# EAGLE design Spin_board2 (EAGLE 9.4.2)
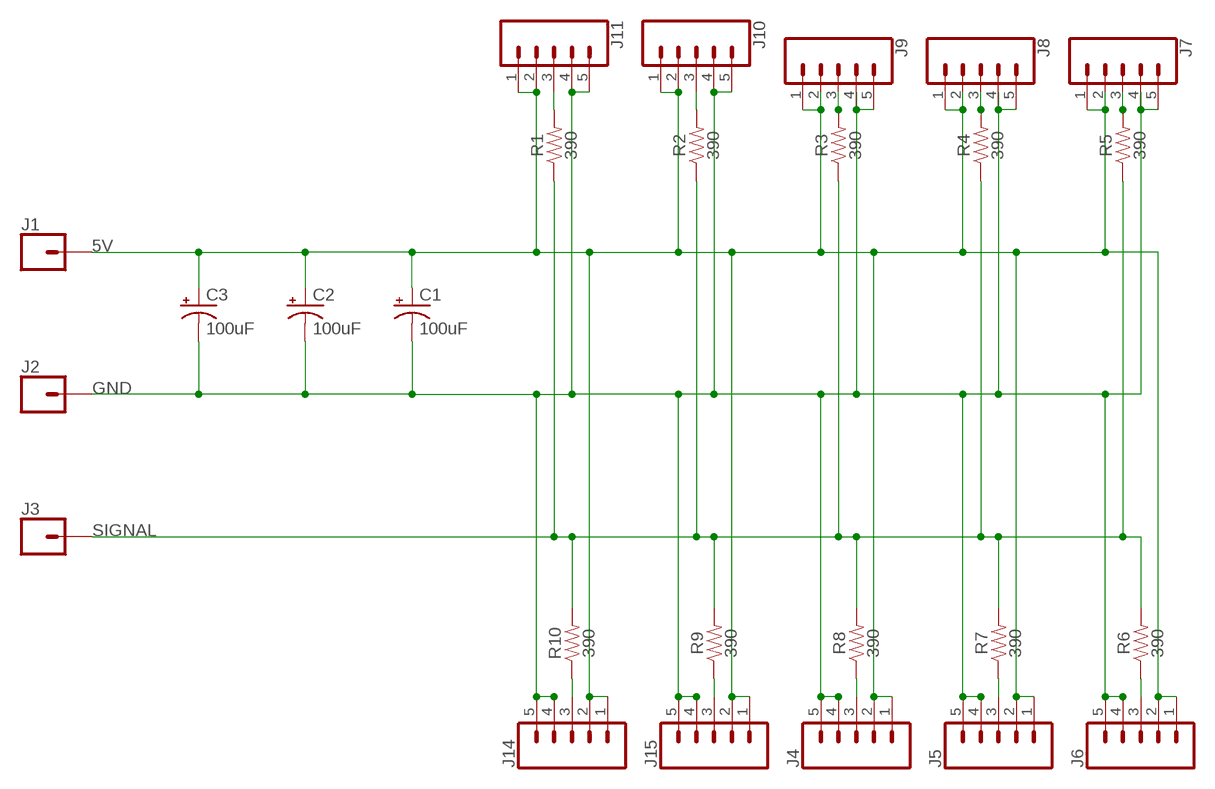
[diagram p0: schematic, sheet 1]

## Parts
C1  100uF  100UF-POLAR-RADIAL-2.5MM-25V-20%  [CPOL-RADIAL-2.5MM-6.5MM]
C2  100uF  100UF-POLAR-RADIAL-2.5MM-25V-20%  [CPOL-RADIAL-2.5MM-6.5MM]
C3  100uF  100UF-POLAR-RADIAL-2.5MM-25V-20%  [CPOL-RADIAL-2.5MM-6.5MM]
J1  CONN_01  [1X01]
J2  CONN_01  [1X01]
J3  CONN_01  [1X01]
J4  CONN_05SMD  [1X05_1MM]
J5  CONN_05SMD  [1X05_1MM]
J6  CONN_05SMD  [1X05_1MM]
J7  CONN_05SMD  [1X05_1MM]
J8  CONN_05SMD  [1X05_1MM]
J9  CONN_05SMD  [1X05_1MM]
J10  CONN_05SMD  [1X05_1MM]
J11  CONN_05SMD  [1X05_1MM]
J14  CONN_05SMD  [1X05_1MM]
J15  CONN_05SMD  [1X05_1MM]
R1  390  390OHM-0603-1/10W-1%  [0603]
R2  390  390OHM-0603-1/10W-1%  [0603]
R3  390  390OHM-0603-1/10W-1%  [0603]
R4  390  390OHM-0603-1/10W-1%  [0603]
R5  390  390OHM-0603-1/10W-1%  [0603]
R6  390  390OHM-0603-1/10W-1%  [0603]
R7  390  390OHM-0603-1/10W-1%  [0603]
R8  390  390OHM-0603-1/10W-1%  [0603]
R9  390  390OHM-0603-1/10W-1%  [0603]
R10  390  390OHM-0603-1/10W-1%  [0603]

## Nets
5V: C1.1(+) C2.1(+) C3.1(+) J1.1 J4.1 J4.2 J5.1 J5.2 J6.1 J6.2 J7.1 J7.2 J8.1 J8.2 J9.1 J9.2 J10.1 J10.2 J11.1 J11.2 J14.1 J14.2 J15.1 J15.2
GND: C1.2(-) C2.2(-) C3.2(-) J2.1 J4.4 J4.5 J5.4 J5.5 J6.4 J6.5 J7.4 J7.5 J8.4 J8.5 J9.4 J9.5 J10.4 J10.5 J11.4 J11.5 J14.4 J14.5 J15.4 J15.5
N$4: J11.3 R1.2
N$5: J10.3 R2.2
N$6: J9.3 R3.2
N$7: J8.3 R4.2
N$8: J7.3 R5.2
N$9: J6.3 R6.1
N$10: J5.3 R7.1
N$11: J4.3 R8.1
N$12: J15.3 R9.1
N$13: J14.3 R10.1
SIGNAL: J3.1 R1.1 R2.1 R3.1 R4.1 R5.1 R6.2 R7.2 R8.2 R9.2 R10.2

## Library data of the parts
C1-C3 = SparkFun-Capacitors:100UF-POLAR: 100µF polarized capacitors A capacitor is a passive two-terminal electrical component used to store electrical energy temporarily in an electric field.; PROD_ID: CAP-08439
J1-J3 = SparkFun-Connectors:CONN_01: Single connection point. Often used as Generic Header-pin footprint for 0.1 inch spaced/style header connections On any of the 0.1 inch spaced packages, you can populate with these: Break Away Headers - Straight <https://www.sparkfun.com/products/116> (PRT-00116) Break Away Male Headers - Right Angle <https://www.sparkfun.com/products/553> (PRT-00553) Female Headers <https://www.sparkfun.com/products/115> (PRT-00115) Break Away Headers - Machine Pin <https://www.sparkfun.com/products/117> (PRT-00117) Break Away Female Headers - Swiss Machine Pin <https://www.sparkfun.com/products/743> (PRT-00743) This device is also useful as a general connection point to wire up your design to another part of your project. Our various solder wires solder well into these plated through hole pads. Hook-Up Wire - Assortment (Stranded, 22 AWG) <https://www.sparkfun.com/products/11375> (PRT-11375) Hook-Up Wire - Assortment (Solid Core, 22 AWG) <https://www.sparkfun.com/products/11367> (PRT-11367) View the entire wire category on our website here <https://www.sparkfun.com/categories/141> Special notes: SMTSO-256-ET is a "flush mount" nut for a 4-40 screw. We mostly use this on specialty testbeds; it is a nice way to connect hardware to your PCB at an adjustable hieght. Also note, the SNAP packages are for using a snappable style connector. We sell a baggie of snaps and they are also used on two LilyPad designs: Snap Assortment - 30 pack (male and female) <https://www.sparkfun.com/products/11347> (DEV-11347) LilyPad Arduino SimpleSnap <https://www.sparkfun.com/products/10941> (DEV-10941) LilyPad SimpleSnap Protoboard <https://www.sparkfun.com/products/10940> (DEV-10940)
J4-J11 J14 J15 = SparkFun-Connectors:CONN_05: Multi connection point. Often used as Generic Header-pin footprint for 0.1 inch spaced/style header connections On any of the 0.1 inch spaced packages, you can populate with these: Break Away Headers - Straight <https://www.sparkfun.com/products/116> (PRT-00116) Break Away Male Headers - Right Angle <https://www.sparkfun.com/products/553> (PRT-00553) Female Headers <https://www.sparkfun.com/products/115> (PRT-00115) Break Away Headers - Machine Pin <https://www.sparkfun.com/products/117> (PRT-00117) Break Away Female Headers - Swiss Machine Pin <https://www.sparkfun.com/products/743> (PRT-00743) For SCREWTERMINALS and SPRING TERMINALS visit here: Screw Terimnals on SparkFun.com <https://www.sparkfun.com/search/results?term=Screw+Terminals> (5mm/3.5mm/2.54mm spacing) This device is also useful as a general connection point to wire up your design to another part of your project. Our various solder wires solder well into these plated through hole pads. Hook-Up Wire - Assortment (Stranded, 22 AWG) <https://www.sparkfun.com/products/11375> (PRT-11375) Hook-Up Wire - Assortment (Solid Core, 22 AWG) <https://www.sparkfun.com/products/11367> (PRT-11367) View the entire wire category on our website here <https://www.sparkfun.com/categories/141> Special notes: Molex polarized connector foot print use with SKU : PRT-08231 with associated crimp pins and housings. 1MM SMD Version SKU: PRT-10208; PROD_ID: CONN-08528; SF_ID: GPS-08288
R1-R10 = SparkFun-Resistors:390OHM: 390Ω resistor A resistor is a passive two-terminal electrical component that implements electrical resistance as a circuit element. Resistors act to reduce current flow, and, at the same time, act to lower voltage levels within circuits. - Wikipedia; PROD_ID: RES-07864

## Board
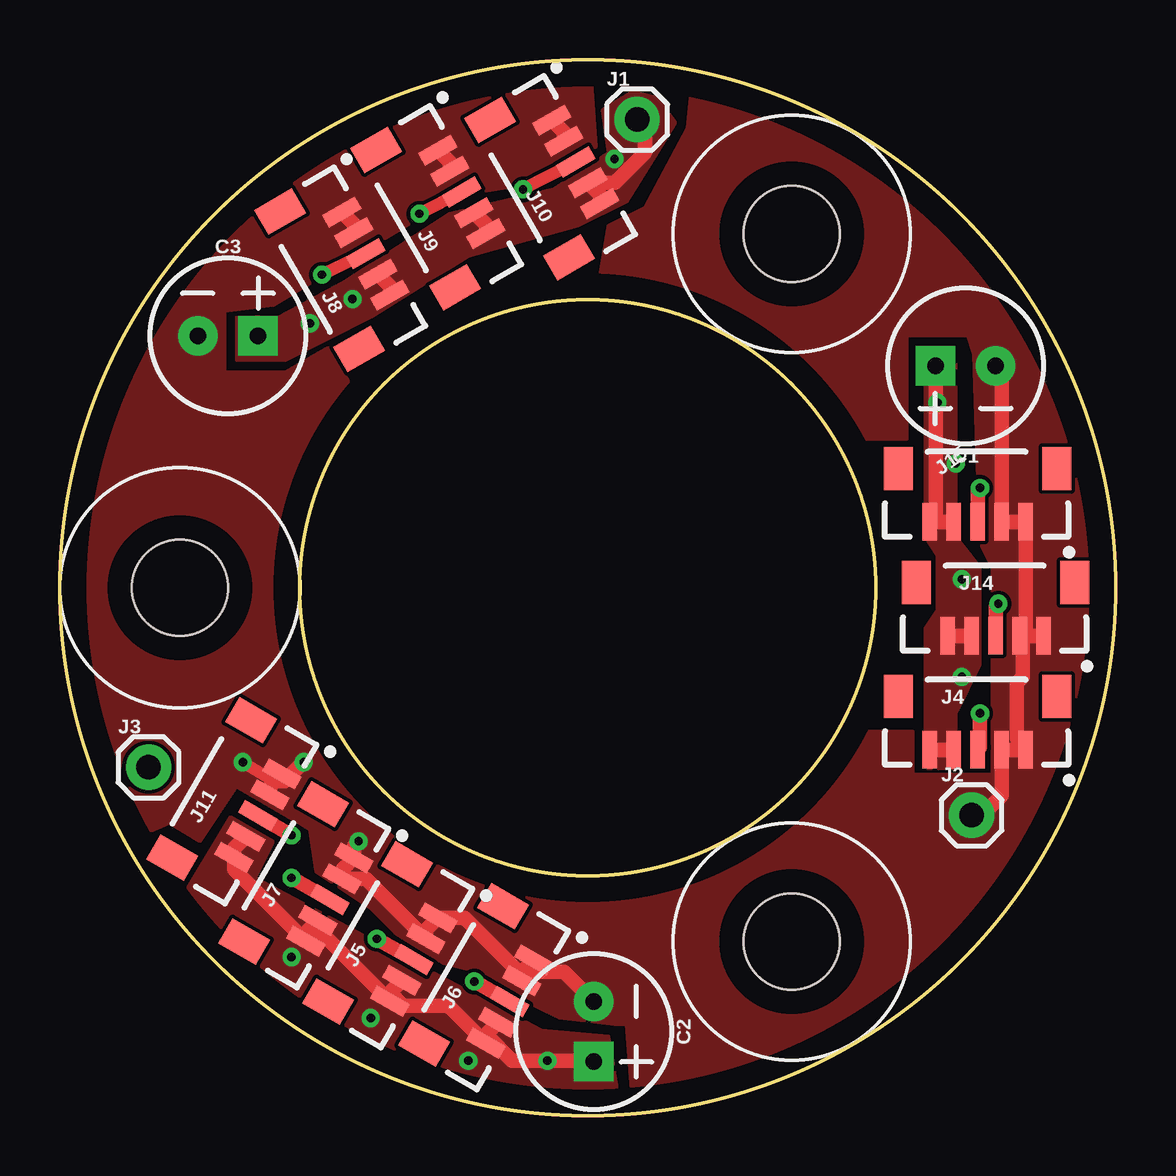
[diagram p1: board, top side]
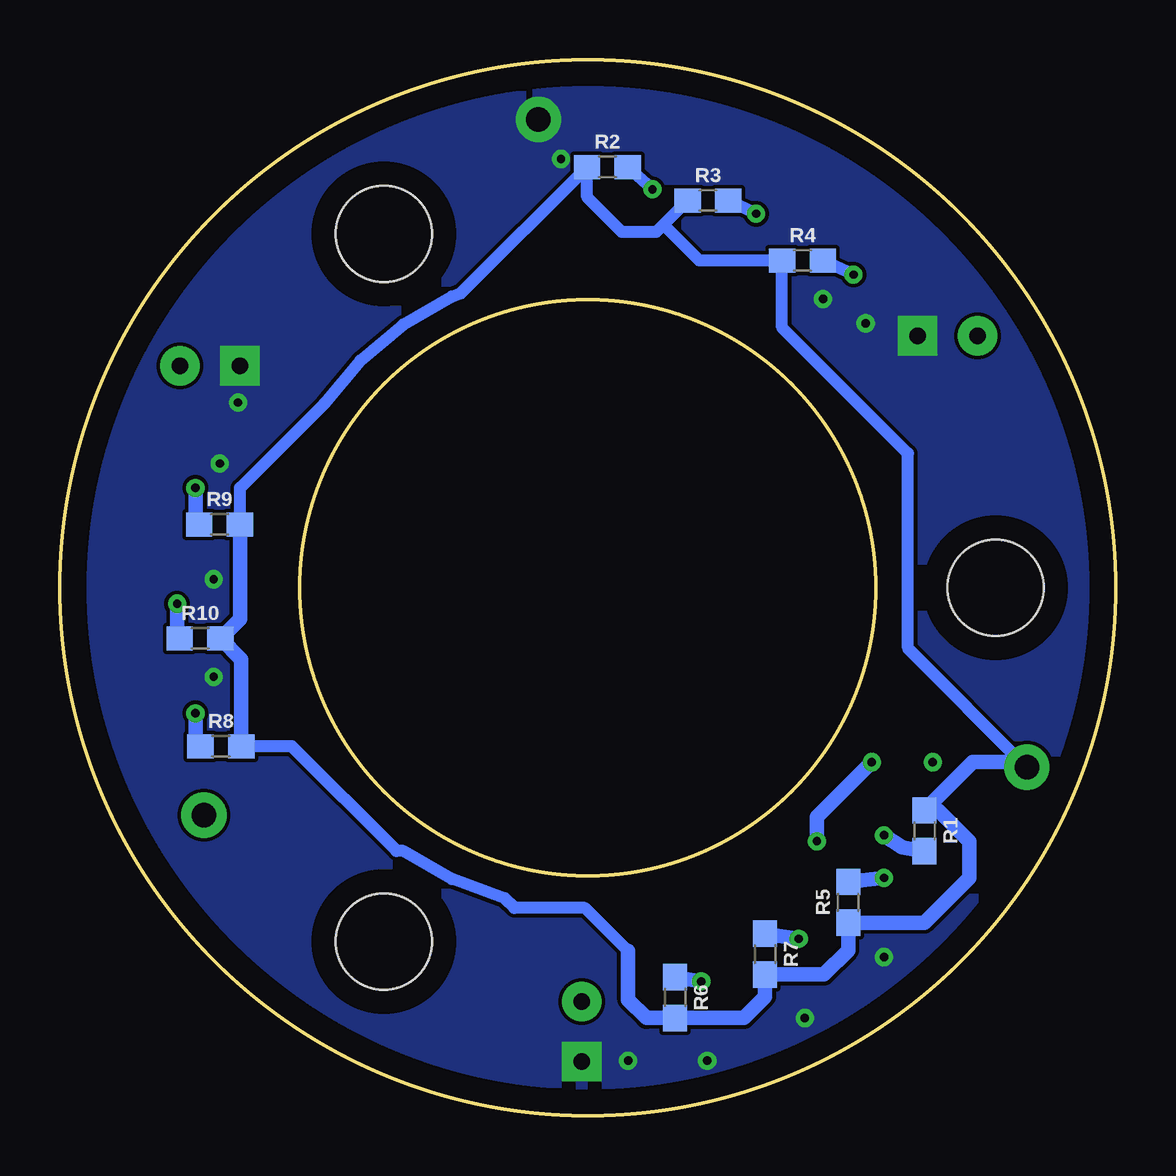
[diagram p2: board, bottom side, seen from below]

Size 44 x 44 mm. Coordinates in mm from the lower left corner, seen from the top.
Outline: circle at 22,22 radius 22
Outline: circle at 22,22 radius 12
Copper layers (1*16): Top 0.035mm / dielectric 1.5mm / Bottom 0.035mm
Design rules "default *": minimum track width 6mil, minimum drill 0.35mm, track to track 6mil, track to pad 6mil, pad to pad 6mil, via to via 6mil, smd to smd 6mil, copper to edge 40mil, drill to drill 6mil, minimum pad ring 10mil, minimum via ring 8mil, stop-mask expansion 4mil, vias tented up to drill 0mil, thermal gap 0mil
Holes 4 mm at 30.5,7.25 30.5,36.75 5,22

### Footprints (pad centres in the part's own frame; a part is rotated, then mirrored left to right if it is on the bottom)
CPOL-RADIAL-2.5MM-6.5MM = drill 0.7 pad 1.651 square: 1 1.25,0 | drill 0.7 pad 1.651: 2 -1.25,0
1X01 = drill 1.016 pad 1.88: 1 0,0
1X05_1MM = smd 0.6 x 1.55: 1 -2,0; 2 -1,0; 3 0,0; 4 1,0; 5 2,0 | smd 1.2 x 1.8: NC1 -3.3,2.225; NC2 3.3,2.225
0603 = smd 1.1 x 1: 1 -0.85,0; 2 0.85,0

### Placement (x,y rotation side)
C1  37.75,31.25 180 top
C2  22.25,3.5 270 top
C3  7,32.5 0 top
J1  24.06,41.52 0 top
J2  38,12.52 0 top
J3  3.69,14.52 0 top
J4  38.25,15.25 0 top
J5  14.75,6.5 60 top
J6  18.75,4.75 60 top
J7  11.25,9 60 top
J8  12.75,35.93 120 top
J9  16.75,38.5 120 top
J10  21.5,39.75 120 top
J11  8.25,12.5 60 top
J14  39,20 0 top
J15  38.25,24.75 0 top
R1  7.96,11.87 270 bottom
R2  21.18,39.54 0 bottom
R3  16.99,38.14 0 bottom
R4  13.05,35.64 0 bottom
R5  11.14,8.89 90 bottom
R6  18.36,4.92 270 bottom
R7  14.61,6.73 270 bottom
R8  37.29,15.39 0 bottom
R9  37.35,24.64 0 bottom
R10  38.16,19.89 0 bottom

### Tracks (layer width: path | path; a pad name or v marks a point on that pad's centre or on a via)
5V  (via drill 0.35)
  Top 0.61: 17.75,3.38 J6.1 16.2,4.57 14.31,4.57 13.75,5.13 | 17.75,3.38 J6.2 | 13.75,5.13 J5.1 10.88,7.63 10.25,7.63 | 13.75,5.13 J5.2 | 10.25,7.63 J7.1 7.25,10.27 J11.1 7.25,11.13 J11.2 | 10.25,7.63 J7.2 | J8.2 13.75,34.57 J8.1 | J9.2 17.75,37.13 J9.1 | J10.1 22.5,38.38 J10.2 23.14,38.88 24.38,40.13 24.38,41.2 J1.1 | J15.2 J15.1 36.5,25 C1.1 | J14.1 J14.2 | J4.1 J4.2 | C2.1 22.21,2.29 v20.32,2.29 18.85,2.29 17.75,3.38
  other vias: 17.02,2.29 12.95,4.06 9.65,6.6 10.41,33.02 12.19,34.04 23.11,39.88 37.59,18.29 37.59,22.35 37.34,27.18 36.58,29.72
  pour Bottom: 1.78,12.95 -0.76,23.37 2.79,33.53 10.41,41.4 20.57,44.45 32.51,41.91 39.62,36.07 44.2,26.92 43.94,18.29 40.64,10.16 34.54,3.05 26.67,0 14.48,0.25 5.84,6.1
  pour Top: 22.86,3.3 20.07,3.56 8.13,9.91 8.89,11.43 7.11,12.45 4.83,8.64 10.16,3.56 18.8,0.25 23.37,0.25
  pour Top: 11.94,34.8 16.26,37.59 20.57,38.61 22.86,40.13 22.61,41.91 23.88,42.67 24.89,42.42 25.65,41.4 24.89,40.13 23.62,38.1 21.59,37.08 17.02,35.81 12.95,33.27
  pour Top: 12.95,33.27 9.4,31.5 7.37,31.5 7.37,33.27 9.14,33.27 11.94,34.8
  pour Top: 37.34,32 37.34,24.13 38.35,22.86 38.35,18.8 37.34,16.76 37.34,14.48 36.07,14.48 36.07,20.32 36.58,21.08 36.58,23.37 36.07,24.13 36.07,32
GND  (via drill 0.35)
  Top 0.508: v7.62,14.73 8.94,13.92
  Top 0.61: J14.4 J14.5 | J2.1 38.43,12.52 39.25,13.34 J4.4 J4.5 40.25,15.38 39.88,15.75 39.88,18.03 40.13,18.29 40.13,19.87 J14.4 | J11.4 8.75,13.73 8.94,13.92 | 8.94,13.92 J11.5 | J6.4 19.25,5.84 | 19.25,5.84 19.25,5.98 | 19.25,5.98 J6.5 | J8.5 12.25,37.16 J8.4 | J9.5 16.25,39.73 J9.4 | J10.5 21,40.98 J10.4 | C1.2 39.25,31 J15.4 J15.5 40.25,20.25 J14.4 | C2.2 21.02,5.98 19.25,5.98 | v12.45,11.43 12.25,11.23 J7.5 11.75,10.23 J7.4 12.75,9.87 J5.4 15.25,7.73 J5.5 16.86,8.23 19.25,5.84 | v10.16,14.73 9.35,13.92 8.94,13.92
  Bottom 0.61: v12.45,11.43 12.45,12.45 v10.16,14.73
  pour Top: 23.88,0.25 30.23,1.52 36.58,5.33 40.89,10.41 42.42,13.72 42.42,14.22 35.56,14.22 35.56,16 32.51,16 29.97,13.21 25.91,10.67 20.57,10.16 15.24,11.94 12.19,14.99 10.16,19.56 0.25,19.05 1.02,14.99 2.79,11.43 4.57,12.19 5.84,11.43 7.37,13.72 10.41,11.94 10.67,10.16 12.95,8.64 13.97,7.62 16,6.35 17.02,6.1 19.81,4.57 20.83,4.06 23.11,3.81 23.62,3.81
  pour Top: 1.27,19.05 10.16,19.3 10.41,23.88 11.43,27.43 12.7,29.46 11.18,32 9.4,30.99 6.86,30.99 6.86,33.53 8.89,33.78 16.51,38.35 19.81,38.86 22.35,40.39 22.1,43.94 17.53,43.69 11.68,41.4 7.37,38.86 3.56,34.29 0.76,28.19 -0.25,22.35
  pour Top: 26.42,43.69 32.26,41.66 36.83,38.61 39.88,35.05 42.42,30.73 43.69,26.92 44.2,22.61 43.94,17.78 42.67,13.97 38.86,13.97 38.86,16 38.86,22.86 38.35,23.88 38.1,31.75 37.85,32.51 35.31,32.51 35.31,28.19 32.51,28.19 29.46,31.5 25.4,33.53 22.35,34.04 22.86,37.08 24.38,37.85 26.16,41.15
N$4  (via drill 0.35)
  Top 0.61: J11.3 v9.65,11.68
  Bottom 0.61: v9.65,11.68 8.89,11.18 R1.2
N$5  (via drill 0.35)
  Top 0.508: J10.3 v19.3,38.61
  Bottom 0.508: v19.3,38.61 R2.2
N$6  (via drill 0.35)
  Top 0.508: J9.3 v14.99,37.59
  Bottom 0.508: v14.99,37.59 R3.2
N$7  (via drill 0.35)
  Top 0.508: J8.3 v10.92,35.05
  Bottom 0.508: v10.92,35.05 R4.2
N$8  (via drill 0.35)
  Top 0.61: J7.3 v9.65,9.91
  Bottom 0.61: v9.65,9.91 R5.2
N$9  (via drill 0.35)
  Top 0.61: J6.3 v17.27,5.59
  Bottom 0.61: v17.27,5.59 R6.1
N$10  (via drill 0.35)
  Top 0.61: J5.3 v13.21,7.37
  Bottom 0.61: v13.21,7.37 R7.1
N$11  (via drill 0.35)
  Top 0.61: J4.3 38.35,15.35 v38.35,16.76
  Bottom 0.61: v38.35,16.76 38.35,15.6 R8.1
N$12  (via drill 0.35)
  Top 0.61: J15.3 38.25,26.06 v38.35,26.16
  Bottom 0.61: v38.35,26.16 38.35,24.79 R9.1
N$13  (via drill 0.35)
  Top 0.61: J14.3 39,21.22 v39.12,21.34
  Bottom 0.61: v39.12,21.34 39.12,20 R10.1
SIGNAL
  Bottom 0.508: 20.32,6.86 22.12,8.65 25.06,8.65 25.47,9.06 27.66,9.86 29.68,11.03 29.97,11.03 34.34,15.39 R8.2 | R9.2 36.5,26.16 32.97,29.68 31.47,31.47 29.68,32.97 27.66,34.14 27.29,34.28 R2.1 22.03,38.29 20.57,36.83 19.15,36.83 18.85,37.13 | R3.1 18.85,37.13 | 18.85,37.13 17.35,35.64 R4.1 13.9,32.85 8.65,27.6 8.65,19.48 J3.1
  Bottom 0.61: R9.2 36.5,20.7 R10.2 36.44,19.02 R8.2 | J3.1 3.9,14.73 5.95,14.73 R1.1 7.39,12.72 6.1,11.43 6.1,9.91 7.96,8.04 R5.1 11.14,6.89 12.15,5.88 R7.2 14.61,4.95 15.49,4.07 R6.2 19.55,4.07 19.56,4.06 20.32,4.83 20.32,6.86